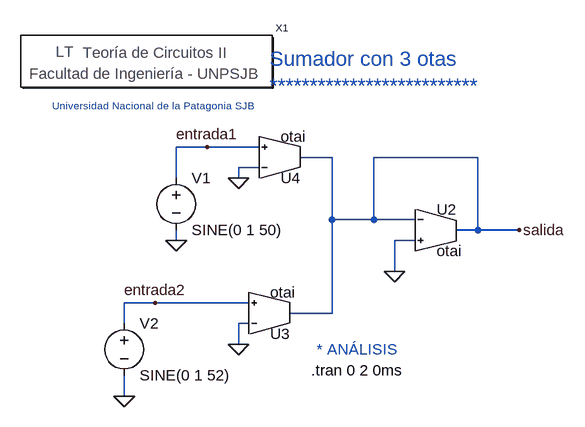
[diagram p0: schematic Sumador con otas.asc]
Sumador con otas.asc, the LTspice schematic file:
Version 4
SHEET 1 880 680
WIRE 112 80 64 80
WIRE 192 80 112 80
WIRE 304 96 256 96
WIRE 528 96 368 96
WIRE 192 112 160 112
WIRE 64 128 64 80
WIRE 160 128 160 112
WIRE 304 192 304 96
WIRE 368 192 368 96
WIRE 368 192 304 192
WIRE 432 192 368 192
WIRE 528 208 528 96
WIRE 528 208 496 208
WIRE 592 208 528 208
WIRE 64 224 64 208
WIRE 432 224 400 224
WIRE 400 272 400 224
WIRE 32 320 -16 320
WIRE 176 320 32 320
WIRE 304 336 304 192
WIRE 304 336 240 336
WIRE -16 352 -16 320
WIRE 176 352 160 352
WIRE 160 384 160 352
WIRE -16 464 -16 432
FLAG 64 224 0
FLAG -16 464 0
FLAG 400 272 0
FLAG 160 128 0
FLAG 160 384 0
FLAG 592 208 salida
FLAG 112 80 entrada1
FLAG 32 320 entrada2
SYMBOL otai 464 144 R0
SYMATTR InstName U2
SYMATTR Value gm=1m
SYMBOL otai 208 400 M180
SYMATTR InstName U3
SYMBOL otai 224 160 M180
SYMATTR InstName U4
SYMBOL voltage 64 112 R0
WINDOW 123 0 0 Left 2
WINDOW 39 0 0 Left 2
SYMATTR InstName V1
SYMATTR Value SINE(0 1 50)
SYMBOL voltage -16 336 R0
WINDOW 123 0 0 Left 2
WINDOW 39 0 0 Left 2
SYMATTR InstName V2
SYMATTR Value SINE(0 1 52)
SYMBOL Circuitos2\\Letreros\\Teoría\ de\ Circuitos\ II 16 -48 R0
SYMATTR InstName X1
TEXT 272 424 Left 2 !.tran 0 2 0ms
TEXT 280 392 Left 2 ;* ANÁLISIS
TEXT 24 16 Center 1 ;Universidad Nacional de la Patagonia SJB
TEXT 208 -56 Left 3 ;Sumador con 3 otas\n**************************

The netlist it stands for:
* Sumador con otas.asc
XU2 0 salida salida otai gm=1m  ; pins p n s
XU3 entrada2 0 salida otai gm=0.001  ; pins p n s
XU4 entrada1 0 salida otai gm=0.001  ; pins p n s
V1 entrada1 0 SINE(0 1 50)
V2 entrada2 0 SINE(0 1 52)
XX1 Teoría de Circuitos II
.tran 0 2 0ms
* * ANÁLISIS
* Universidad Nacional de la Patagonia SJB
* Sumador con 3 otas
* **************************
.lib ..\sym\Circuitos2\ComponentesIdeales\compoideales.lib
.backanno
.end